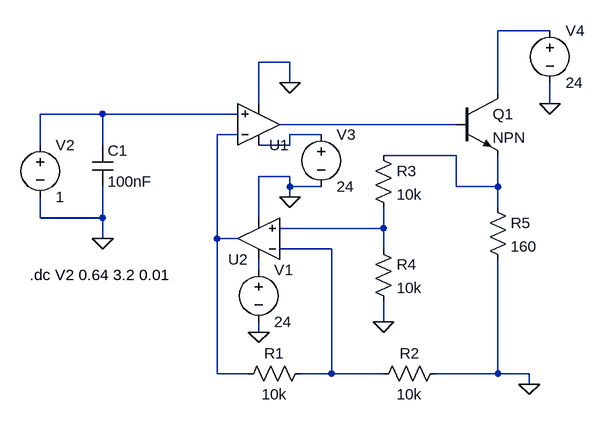
[diagram p0: schematic DAC.asc]
DAC.asc, the LTspice schematic file:
Version 4.1
SHEET 1 880 680
WIRE 608 0 528 0
WIRE 208 48 160 48
WIRE 208 80 208 48
WIRE 528 96 528 0
WIRE 160 112 160 48
WIRE 608 112 608 80
WIRE -80 128 -176 128
WIRE 128 128 -80 128
WIRE 464 144 192 144
WIRE 128 160 96 160
WIRE 256 160 208 160
WIRE -176 176 -176 128
WIRE -80 176 -80 128
WIRE 208 176 208 160
WIRE 208 176 160 176
WIRE 464 192 352 192
WIRE 208 224 160 224
WIRE 208 240 208 224
WIRE 256 240 208 240
WIRE 464 240 464 192
WIRE 528 240 528 192
WIRE 528 240 464 240
WIRE 208 256 208 240
WIRE 528 272 528 240
WIRE -176 288 -176 256
WIRE -80 288 -80 240
WIRE -80 288 -176 288
WIRE 160 288 160 224
WIRE 352 304 352 272
WIRE 352 304 192 304
WIRE -80 320 -80 288
WIRE 96 320 96 160
WIRE 128 320 96 320
WIRE 272 336 192 336
WIRE 352 336 352 304
WIRE 160 368 160 352
WIRE 352 448 352 416
WIRE 160 464 160 448
WIRE 96 528 96 320
WIRE 144 528 96 528
WIRE 272 528 272 336
WIRE 272 528 224 528
WIRE 352 528 272 528
WIRE 528 528 528 352
WIRE 528 528 432 528
WIRE 576 528 528 528
WIRE 576 544 576 528
FLAG -80 320 0
FLAG 352 448 0
FLAG 208 256 0
FLAG 208 80 0
FLAG 160 464 0
FLAG 608 112 0
FLAG 576 544 0
SYMBOL cap -96 176 R0
SYMATTR InstName C1
SYMATTR Value 100nF
SYMBOL res 128 544 R270
WINDOW 0 32 56 VTop 2
WINDOW 3 0 56 VBottom 2
SYMATTR InstName R1
SYMATTR Value 10k
SYMBOL res 336 544 R270
WINDOW 0 32 56 VTop 2
WINDOW 3 0 56 VBottom 2
SYMATTR InstName R2
SYMATTR Value 10k
SYMBOL res 336 176 R0
SYMATTR InstName R3
SYMATTR Value 10k
SYMBOL res 336 320 R0
SYMATTR InstName R4
SYMATTR Value 10k
SYMBOL res 512 256 R0
SYMATTR InstName R5
SYMATTR Value 160
SYMBOL npn 464 96 R0
SYMATTR InstName Q1
SYMBOL voltage -176 160 R0
SYMATTR InstName V2
SYMATTR Value 1
SYMBOL OpAmps\\UniversalOpAmp 160 144 M180
SYMATTR InstName U1
SYMBOL OpAmps\\UniversalOpAmp 160 320 R180
SYMATTR InstName U2
SYMBOL voltage 160 352 R0
SYMATTR InstName V1
SYMATTR Value 24
SYMBOL voltage 256 144 R0
SYMATTR InstName V3
SYMATTR Value 24
SYMBOL voltage 608 -16 R0
SYMATTR InstName V4
SYMATTR Value 24
TEXT -192 376 Left 2 !.dc V2 0.64 3.2 0.01

The netlist it stands for:
* DAC.asc
C1 N002 0 100nF
R1 N004 N008 10k
R2 N008 0 10k
R3 N006 N007 10k
R4 N007 0 10k
R5 N006 0 160
Q1 N001 N003 N006 0 NPN
V2 N002 0 1
X§U1 N002 N004 N005 0 N003 level1 Avol=1Meg GBW=10Meg Vos=0 En=0 Enk=0 In=0 Ink=0 Rin=500Meg  ; pins In+ In- V+ V- OUT
X§U2 N007 N008 N009 0 N004 level1 Avol=1Meg GBW=10Meg Vos=0 En=0 Enk=0 In=0 Ink=0 Rin=500Meg  ; pins In+ In- V+ V- OUT
V1 N009 0 24
V3 N005 0 24
V4 N001 0 24
.model NPN NPN
.model PNP PNP
.lib standard.bjt
.dc V2 0.64 3.2 0.01
.lib UniversalOpAmp1.lib
.backanno
.end